# EAGLE design passive_template_v1_2 (EAGLE 4.16)
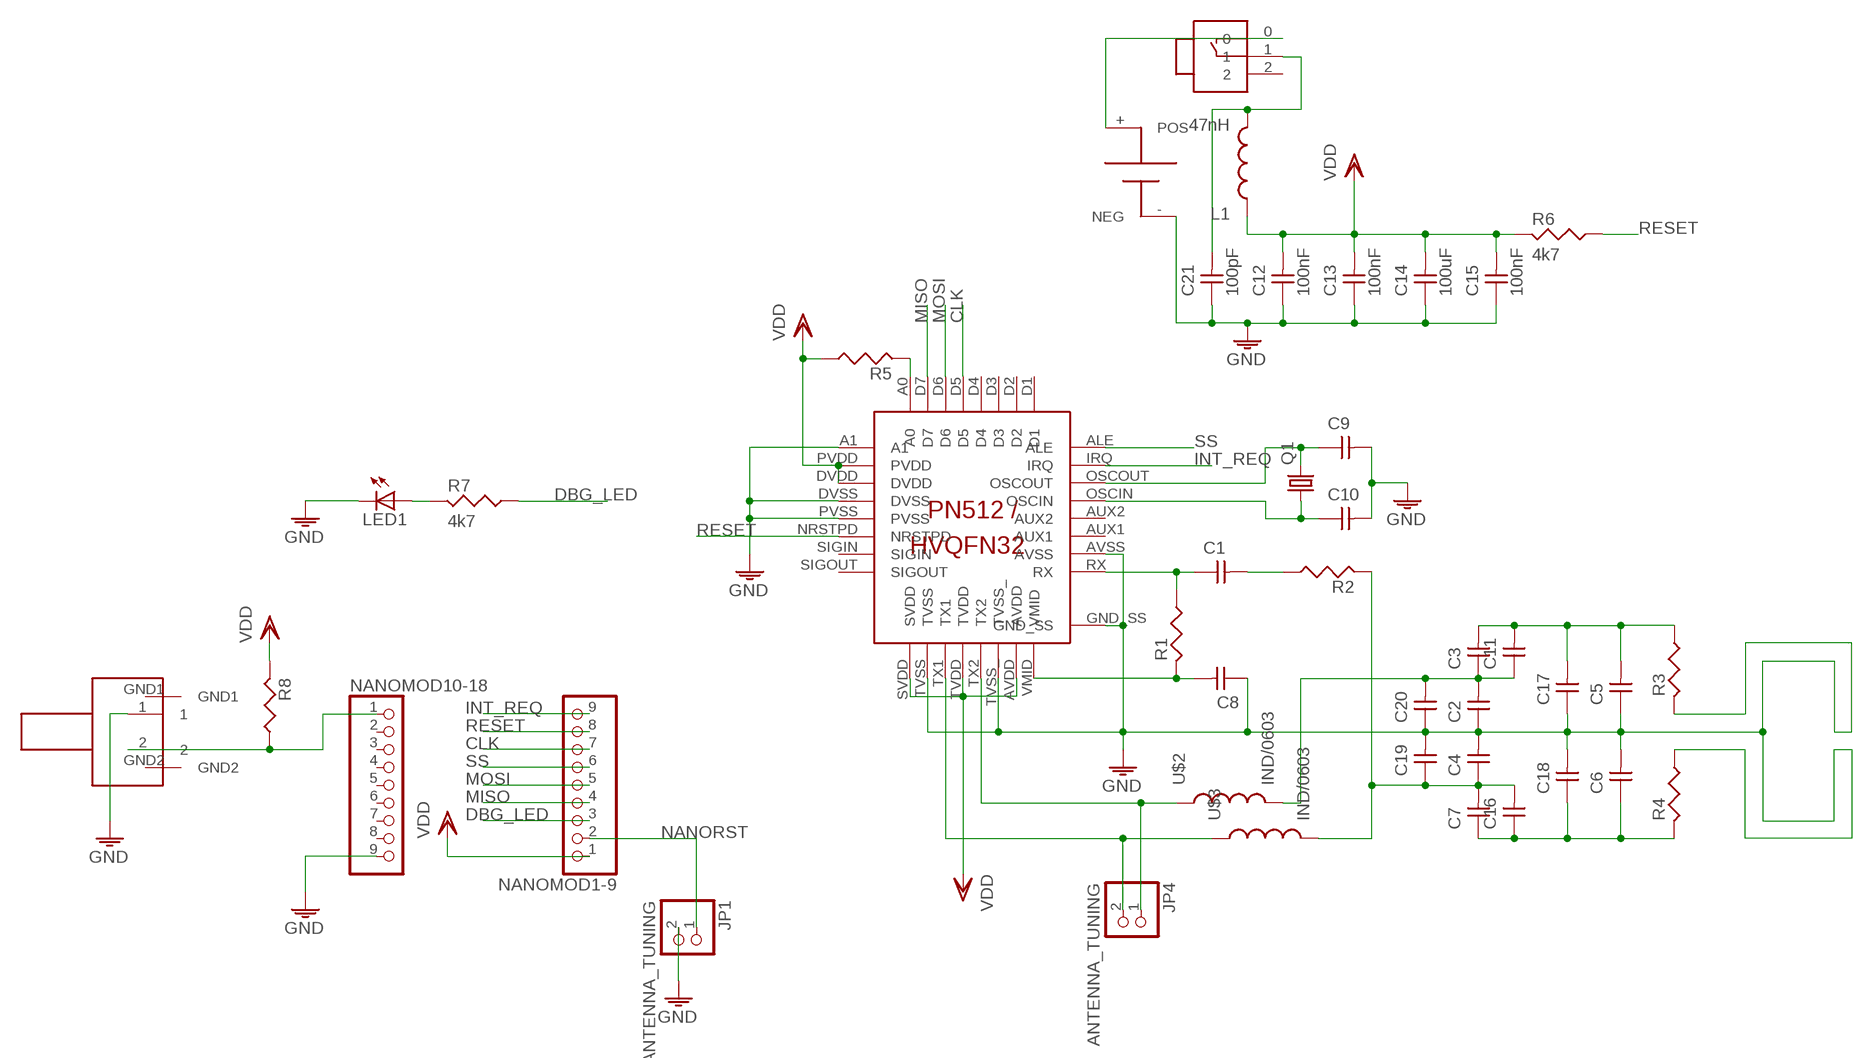
[diagram p0: schematic, sheet 1]

## Parts
C1  CAP/NP/0603  [SMD/0603/NP]
C2  CAP/NP/0603  [SMD/0603/NP]
C3  CAP/NP/0603  [SMD/0603/NP]
C4  CAP/NP/0603  [SMD/0603/NP]
C5  CAP/NP/0603  [SMD/0603/NP]
C6  CAP/NP/0603  [SMD/0603/NP]
C7  CAP/NP/0603  [SMD/0603/NP]
C8  CAP/NP/0603  [SMD/0603/NP]
C9  CAP/NP/0603  [SMD/0603/NP]
C10  CAP/NP/0603  [SMD/0603/NP]
C11  CAP/NP/0603  [SMD/0603/NP]
C12  100nF  CAP/NP/0805  [SMD/0805/NP]
C13  100nF  CAP/NP/0805  [SMD/0805/NP]
C14  100uF  CAP/NP/0805  [SMD/0805/NP]
C15  100nF  CAP/NP/0805  [SMD/0805/NP]
C16  CAP/NP/0603  [SMD/0603/NP]
C17  CAP/NP/0603  [SMD/0603/NP]
C18  CAP/NP/0603  [SMD/0603/NP]
C19  CAP/NP/0603  [SMD/0603/NP]
C20  CAP/NP/0603  [SMD/0603/NP]
C21  100pF  CAP/NP/0805  [SMD/0805/NP]
JP1  ANTENNA_TUNING  PINHD-1X2  [1X02]
JP4  ANTENNA_TUNING  PINHD-1X2  [1X02]
L1  47nH  IND/0805  [SMD/0805/NP]
LED1  LEDSFH482  [SFH482]
NANOMOD1-9  PINHD-1X9  [1X09]
NANOMOD10-18  PINHD-1X9  [1X09]
Q1  CRYSTAL/SM49  [SM49]
R1  RESISTOR/0603  [SMD/0603/NP]
R2  RESISTOR/0603  [SMD/0603/NP]
R3  RESISTOR/0603  [SMD/0603/NP]
R4  RESISTOR/0603  [SMD/0603/NP]
R5  RESISTOR/0603  [SMD/0603/NP]
R6  4k7  RESISTOR/0805  [SMD/0805/NP]
R7  4k7  RESISTOR/0805  [SMD/0805/NP]
R8  RESISTOR/0603  [SMD/0603/NP]
U$1  PN512  [PN512]
U$2  IND/0603  [SMA/0603]
U$3  IND/0603  [SMA/0603]
U$4  SMD/BAT  [SMD/BAT]
U$5  BUTN1  [BUTN1]
U$6  BUTN2  [BUTN2]

## Nets
CLK: NANOMOD1-9.7 U$1.D5
DBG_LED: NANOMOD1-9.3 R7.1
GND: C2.1 C4.2 C5.1 C6.2 C8.1 C9.2 C10.2 C12.1 C13.1 C14.1 C15.1 C17.1 C18.2 C19.2 C20.1 C21.1 JP1.2 LED1.K(C) NANOMOD10-18.9 R3.2 R4.1 U$1.A1 U$1.AVSS U$1.DVSS U$1.GND_SS U$1.PVSS U$1.TVSS U$1.TVSS_ U$4.-(NEG) U$6.1
INT_REQ: NANOMOD1-9.9 U$1.IRQ
MISO: NANOMOD1-9.4 U$1.D7
MOSI: NANOMOD1-9.5 U$1.D6
N$1: JP4.1 U$1.TX2 U$2.1
N$2: C1.1 R1.1 U$1.RX
N$3: C8.2 R1.2 U$1.VMID
N$4: JP4.2 U$1.TX1 U$3.1
N$5: C1.2 R2.1
N$6: C4.1 C7.2 C16.2 C19.1 R2.2 U$3.2
N$7: C2.2 C3.1 C11.1 C20.2 U$2.2
N$8: U$4.+(POS) U$5.0
N$9: C21.2 L1.2 U$5.1
N$10: R5.2 U$1.A0
N$12: C9.1 Q1.2 U$1.OSCOUT
N$13: C10.1 Q1.1 U$1.OSCIN
N$14: LED1.A R7.2
N$17: NANOMOD10-18.1 R8.1 U$6.2
N$18: C3.2 C5.2 C11.2 C17.2 R3.1
N$19: C6.1 C7.1 C16.1 C18.1 R4.2
NANORST: JP1.1 NANOMOD1-9.2
RESET: NANOMOD1-9.8 R6.1 U$1.NRSTPD
SS: NANOMOD1-9.6 U$1.ALE
VDD: C12.2 C13.2 C14.2 C15.2 L1.1 NANOMOD1-9.1 R5.1 R6.2 R8.2 U$1.AVDD U$1.DVDD U$1.PVDD U$1.SVDD U$1.TVDD
Unconnected: NANOMOD10-18.2 NANOMOD10-18.3 NANOMOD10-18.4 NANOMOD10-18.5 NANOMOD10-18.6 NANOMOD10-18.7 NANOMOD10-18.8 U$1.AUX1 U$1.AUX2 U$1.D1 U$1.D2 U$1.D3 U$1.D4 U$1.SIGIN U$1.SIGOUT U$5.2 U$6.GND1 U$6.GND2

## Library data of the parts
C1-C21 = atomi_sm:CAP/NP
JP1 JP4 = pinhead:PINHD-1X2: PIN HEADER
L1 = atomi_sm:IND
LED1 = led:LED: LED OSRAM: - CHIPLED LG R971, LG N971, LY N971, LG Q971, LY Q971, LO R971, LY R971 LH N974, LH R974 LS Q976, LO Q976, LY Q976 LO Q996 - Hyper CHIPLED LW Q18S LB Q993, LB Q99A, LB R99A - SideLED LS A670, LO A670, LY A670, LG A670, LP A670 LB A673, LV A673, LT A673, LW A673 LH A674 LY A675 LS A676, LA A676, LO A676, LY A676, LW A676 LS A679, LY A679, LG A679 - Hyper Micro SIDELED® LS Y876, LA Y876, LO Y876, LY Y876 LT Y87S - SmartLED LW L88C, LW L88S LB L89C, LB L89S, LG L890 LS L89K, LO L89K, LY L89K LS L896, LA L896, LO L896, LY L896 - TOPLED LS T670, LO T670, LY T670, LG T670, LP T670 LSG T670, LSP T670, LSY T670, LOP T670, LYG T670 LG T671, LOG T671, LSG T671 LB T673, LV T673, LT T673, LW T673 LH T674 LS T676, LA T676, LO T676, LY T676, LB T676, LH T676, LSB T676, LW T676 LB T67C, LV T67C, LT T67C, LS T67K, LO T67K, LY T67K, LW E67C LS E67B, LA E67B, LO E67B, LY E67B, LB E67C, LV E67C, LT E67C LW T67C LS T679, LY T679, LG T679 LS T770, LO T770, LY T770, LG T770, LP T770 LB T773, LV T773, LT T773, LW T773 LH T774 LS E675, LA E675, LY E675, LS T675 LS T776, LA T776, LO T776, LY T776, LB T776 LHGB T686 LT T68C, LB T68C - Hyper Mini TOPLED® LB M676 - Mini TOPLED Santana® LG M470 LS M47K, LO M47K, LY M47K Source: http://www.osram.convergy.de - LUMILED® LXK2-PW12-R00, LXK2-PW12-S00, LXK2-PW14-U00, LXK2-PW14-V00 LXK2-PM12-R00, LXK2-PM12-S00, LXK2-PM14-U00 LXK2-PE12-Q00, LXK2-PE12-R00, LXK2-PE12-S00, LXK2-PE14-T00, LXK2-PE14-U00 LXK2-PB12-K00, LXK2-PB12-L00, LXK2-PB12-M00, LXK2-PB14-N00, LXK2-PB14-P00, LXK2-PB14-Q00 LXK2-PR12-L00, LXK2-PR12-M00, LXK2-PR14-Q00, LXK2-PR14-R00 LXK2-PD12-Q00, LXK2-PD12-R00, LXK2-PD12-S00 LXK2-PH12-R00, LXK2-PH12-S00 LXK2-PL12-P00, LXK2-PL12-Q00, LXK2-PL12-R00 Source: www.luxeon.com
NANOMOD1-9 NANOMOD10-18 = pinhead:PINHD-1X9: PIN HEADER
Q1 = atomi_sm:CRYSTAL: CRYSTAL
R1-R8 = atomi_sm:RESISTOR
U$1 = RFIDlib:PN512
U$2 U$3 = _uusi:IND/0603
U$4 = _uusi:SMD/BAT
U$5 = _uusi:BUTN1
U$6 = _uusi:BUTN2

## Board
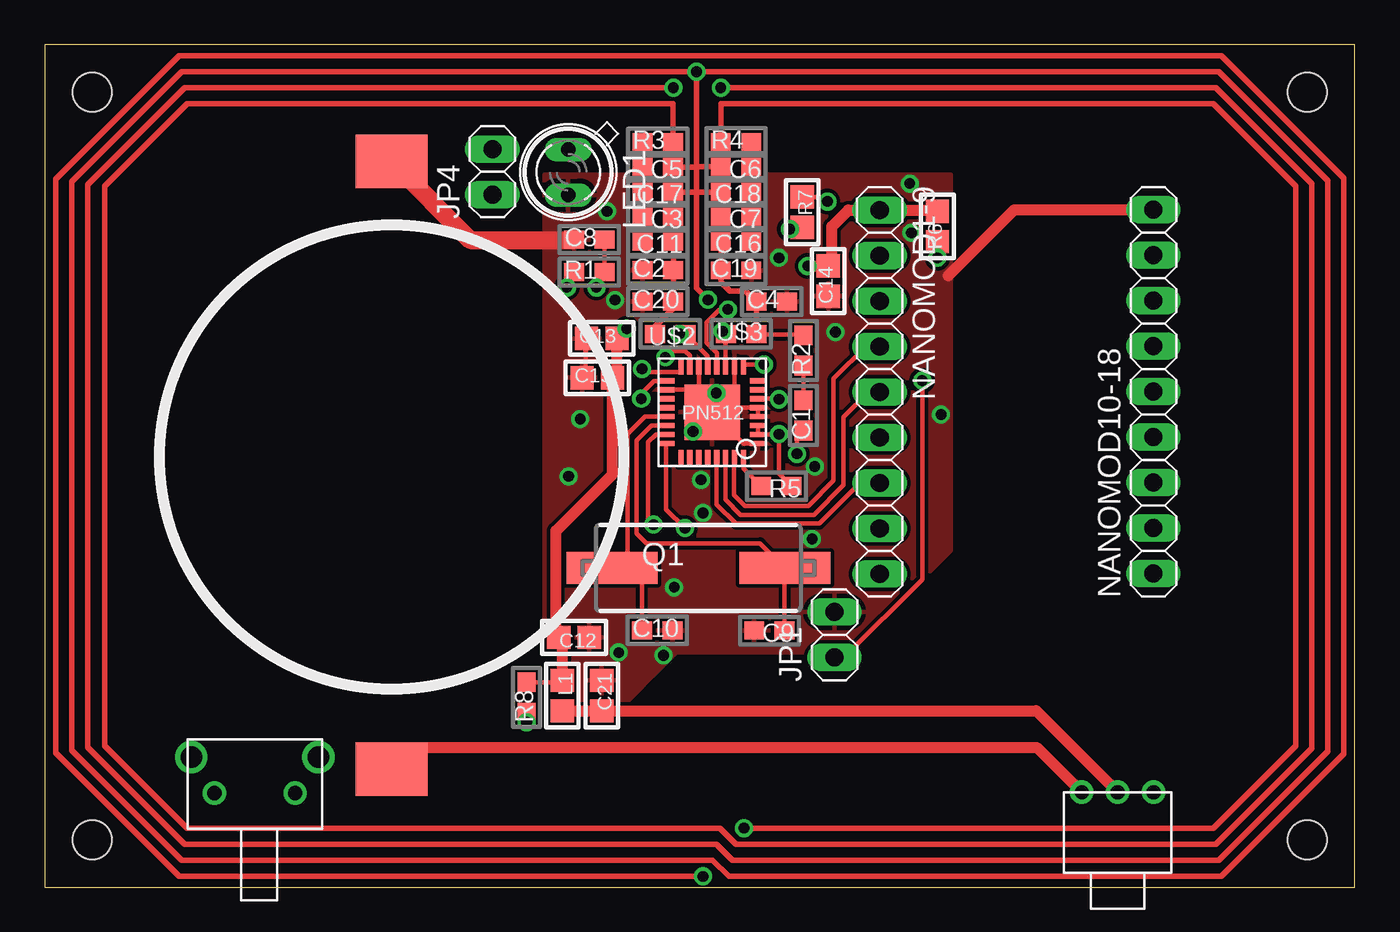
[diagram p1: board, top side]
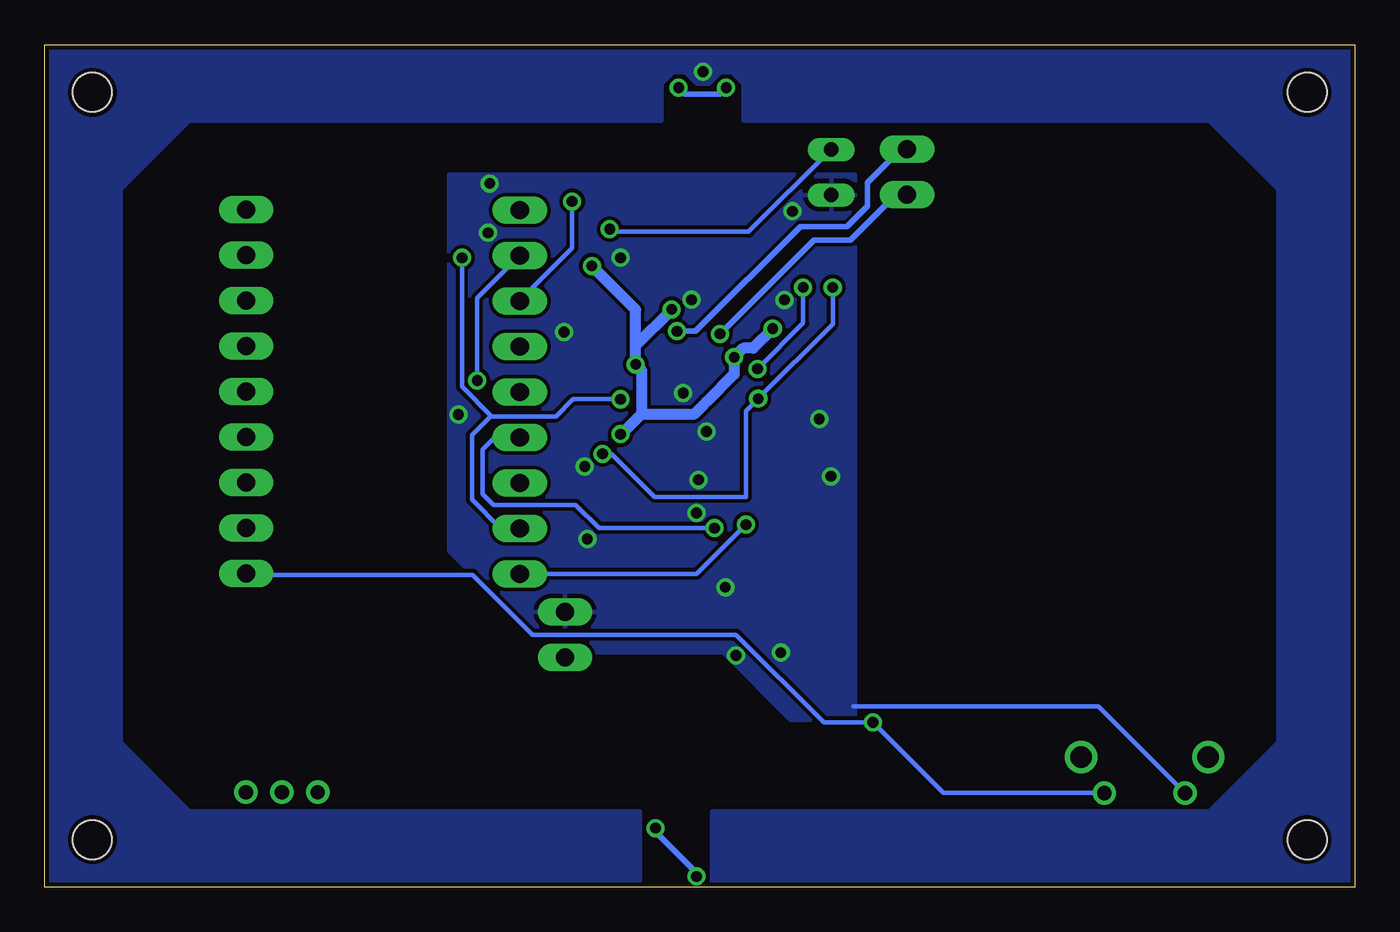
[diagram p2: board, bottom side, seen from below]

Size 73.15 x 47.05 mm. Coordinates in mm from the lower left corner, seen from the top.
Outline: 73.15,47.05 0,47.05 0,0 73.15,0 73.15,47.05
Copper layers (1*16): Top 0.0356mm / dielectric 1.5011mm / Bottom 0.0356mm
Design rules "Atomi": minimum track width 10mil, minimum drill 0.5994mm, track to track 8mil, track to pad 8mil, pad to pad 8mil, via to via 8mil, smd to smd 8mil, copper to edge 10mil, drill to drill 10mil, minimum pad ring 10mil, minimum via ring 8mil, stop-mask expansion 0mil, vias tented up to drill 0mil, thermal gap 10mil
Holes 2.2 mm at 70.5,44.4 2.65,44.4 70.5,2.65 2.65,2.65

### Footprints (pad centres in the part's own frame; a part is rotated, then mirrored left to right if it is on the bottom)
SMD/0603/NP = smd 1.1 x 1: 1 -0.85,0; 2 0.85,0
SMD/0805/NP = smd 1.3 x 1.3: 1 -0.85,0; 2 0.85,0
1X02 = drill 1.016 long: 1 -1.27,0; 2 1.27,0
SFH482 = drill 0.813 long: A -1.27,0; K 1.27,0
1X09 = drill 1.016 long: 1 -10.16,0; 2 -7.62,0; 3 -5.08,0; 4 -2.54,0; 5 0,0; 6 2.54,0; 7 5.08,0; 8 7.62,0; 9 10.16,0
SM49 = smd 5.08 x 1.778: 1 -4.826,0; 2 4.826,0
PN512 = smd 0.29 x 0.9: A0 -2.3,2.3; AVDD 0.7,-2.8; D1 1.2,2.3; D2 0.7,2.3; D3 0.2,2.3; D4 -0.3,2.3; D5 -0.8,2.3; D6 -1.3,2.3; D7 -1.8,2.3; SVDD -2.3,-2.8; TVDD -0.8,-2.8; TVSS -1.8,-2.8; TVSS_ 0.2,-2.8; TX1 -1.3,-2.8; TX2 -0.3,-2.8; VMID 1.2,-2.8 | smd 0.9 x 0.29: A1 -3.1,1.5; ALE 2,1.5; AUX1 2,-1; AUX2 2,-0.5; AVSS 2,-1.5; DVDD -3.1,0.5; DVSS -3.1,0; IRQ 2,1; NRSTPD -3.1,-1; OSCIN 2,0; OSCOUT 2,0.5; PVDD -3.1,1; PVSS -3.1,-0.5; RX 2,-2; SIGIN -3.1,-1.5; SIGOUT -3.1,-2 | smd 3.1 x 3.1: GND_SS -0.55,-0.25
SMA/0603 = smd 1.1 x 1: 1 -0.85,0; 2 0.85,0
SMD/BAT = smd 4 x 3: + 0,13.62; - 0,-20.32
BUTN1 = drill 0.8 round: 0 2.54,10.54; 1 2.54,8.54; 2 2.54,6.54
BUTN2 = drill 0.8 round: 1 0,9; 2 0,4.5 | drill 1.2 round: GND1 2,10.3; GND2 2,3.2

### Placement (x,y rotation side)
C1  42.37,26.35 90 top
C2  34.23,34.46 0 top
C3  34.23,37.44 180 top
C4  40.59,32.71 0 top
C5  34.23,40.22 180 top
C6  38.6,40.23 180 top
C7  38.6,37.45 180 top
C8  30.41,36.17 0 top
C9  40.46,14.33 180 top
C10  34.2,14.35 0 top
C11  34.23,36.05 180 top
C12  29.55,13.95 180 top
C13  31.1,30.65 0 top
C14  43.75,33.85 90 top
C15  30.85,28.45 0 top
C16  38.6,36.06 180 top
C17  34.23,38.83 180 top
C18  38.6,38.84 180 top
C19  38.6,34.45 0 top
C20  34.23,32.71 0 top
C21  31.1,10.7 270 top
JP1  44.1,14.1 90 top
JP4  25,39.95 90 top
L1  28.9,10.7 270 top
LED1  29.23,39.93 270 top
NANOMOD1-9  46.63,27.66 270 top
NANOMOD10-18  61.91,27.68 90 top
Q1  36.5,17.83 0 top
R1  30.41,34.35 0 top
R2  42.37,29.98 90 top
R3  34.23,41.61 0 top
R4  38.6,41.62 0 top
R5  40.85,22.4 180 top
R6  49.85,36.9 90 top
R7  42.3,37.7 270 top
R8  26.9,10.6 90 top
U$1  36.72,26.28 180 top
U$2  34.93,30.9 180 top
U$3  38.89,30.9 0 top
U$4  19.37,20.22 180 top
U$5  68.45,2.76 90 top
U$6  18.48,5.26 90 top

### Tracks (layer width: path | path; a pad name or v marks a point on that pad's centre or on a via)
CLK
  Top 0.254: NANOMOD1-9.7 45.53,22.58 43.25,20.3 38.6,20.3 37.52,21.38 U$1.D5
DBG_LED  (via drill 0.6)
  Top 0.254: R7.1 43.45,38.55 v43.7,38.3
  Bottom 0.254: NANOMOD1-9.3 46.65,32.75 43.7,35.7 v43.7,38.3
GND  (via drill 0.6)
  Top 0.254: U$1.PVSS 39.85,26.79 | 38.52,26.79 U$1.TVSS | 38.52,26.79 38.7,26.79 | 38.7,26.79 U$1.PVSS | U$1.PVSS | U$1.PVSS U$1.DVSS | U$1.A1 39.02,24.78 38.7,25.1 38.7,26.79 | C13.1 30.2,30.65 30.2,28.95 C15.1 | v29.25,22.95 29.35,22.95 | U$1.AVSS 34.72,27.8 36.52,27.8 | 36.52,27.8 U$1.TVSS_ | 36.52,27.8 37.5,27.8 v37.5,27.6 37.5,26.75 37.3,26.55 | 38.52,26.79 37.54,26.79 37.3,26.55 | 37.3,26.55 U$1.GND_SS | 37.3,26.55 v36.2,25.45 | v37.05,32.82 v37.05,32.8 v37.04,32.81 | 29.65,36.15 29.58,36.15 C8.1
  Top 0.305: R4.1 37.75,43.75 65.25,43.75 69.85,39.15 69.85,7.9 65.25,3.3 v39.05,3.3 | v37.05,32.82 36.4,33.47 36.4,38.83 | v36.4,45.55 65.55,45.55 71.65,39.45 71.65,7.6 65.55,1.5 38.4,1.5 37.5,2.4 7.8,2.4 2.4,7.8 2.4,39.25 2.5,39.35 | R3.2 35.08,43.75 7.95,43.75 3.35,39.15 3.35,7.9 7.95,3.3 37.7,3.3 38.6,2.4 65.4,2.4 70.75,7.75 70.75,39.3 65.4,44.65 v37.75,44.65 | 36.4,43.6 36.4,40.23 | 36.4,40.22 36.4,38.83 | 36.4,43.6 36.4,43.75 | v36.4,45.55 7.65,45.55 1.5,39.4 1.5,7.65 7.65,1.5 37.3,1.5 38.2,0.6 65.7,0.6 72.55,7.45 72.55,39.6 65.7,46.45 7.5,46.45 0.6,39.55 0.6,7.5 7.5,0.6 v36.75,0.6 | v35.1,44.65 7.8,44.65 2.5,39.35 | 2.5,39.35 2.45,39.3 | v36.4,45.55 36.4,43.6 | 36.4,40.22 C5.1 | 36.4,40.23 36.4,40.22 | 36.4,40.23 C6.2 | C18.2 36.42,38.83 | 36.4,38.83 36.42,38.83 | 36.42,38.83 C17.1
  Top 0.61: NANOMOD10-18.9 54.14,37.84 50.45,34.15
  Top 1.016: 29.53,36.2 C8.1 29.54,36.15 | C13.1 30.25,30.6 | U$4.- 23.76,36.15 29.58,36.15
  Bottom 0.254: U$6.1 14.32,10.1 28,10.1
  Bottom 0.305: v36.75,0.6 36.75,0.8 39.05,3.1 v39.05,3.3 | v35.1,44.65 35.45,44.3 37.4,44.3 v37.75,44.65
  other vias: 43,23.5 42.85,19.45 29.9,26.15 35.15,16.75 36.65,22.75 36.75,20.9 32.05,13.1 50.05,26.4 31.85,32.8 44.15,31 48.4,36.55 48.3,39.3 41,35.15 31.4,37.75 34.55,12.95
  pour Bottom: 27.9,9.35 27.9,39.8 50.58,39.8 50.58,18.79 44.9,13.1 35.25,13.1 31.5,9.35
  pour Top: 27.9,9.35 27.9,39.8 33.75,39.8 33.75,31.7 39.05,31.7 39.05,39.8 50.6,39.8 50.6,18.8 44.9,13.1 35.25,13.1 31.5,9.35
  pour Bottom: 34.75,45.55 35.45,45.55 36.1,44.9 36.7,44.9 37.35,45.55 38.1,45.55 38.75,44.9 38.75,42.85 65.1,42.85 68.95,39 68.95,8.05 65.1,4.2 39.95,4.2 39.95,0 73.15,0 73.15,47.05 0,47.05 0,0 35.85,0 35.85,4.2 8.1,4.2 4.25,8.05 4.25,39 8.1,42.85 34.1,42.85 34.1,44.9
INT_REQ  (via drill 0.6)
  Top 0.254: U$1.IRQ 34.13,25.28 33.7,24.85 33.7,20.55 v34,20.25
  Bottom 0.254: v34,20.25 36.75,17.5 NANOMOD1-9.9
MISO
  Top 0.254: U$1.D7 38.5,24 38.5,21.9 39.1,21.3 42.65,21.3 44.05,22.7 44.05,28.4 45.9,30.25 46.65,30.25 46.65,30.22 NANOMOD1-9.4
MOSI
  Top 0.254: U$1.D6 38,24 38,21.65 38.85,20.8 42.95,20.8 44.6,22.45 44.6,26.25 46.01,27.66 NANOMOD1-9.5
N$1  (via drill 0.6)
  Top 0.254: U$1.TX2 37.02,29.65 35.81,30.86 35.81,30.87 U$2.1 | U$2.1 35.8,30.9 | v35.45,30.9 U$2.1
  Bottom 0.305: JP4.1 25.62,38.68 28.15,36.15 30.2,36.15 v35.45,30.9
N$2  (via drill 0.6)
  Top 0.254: U$1.RX 34.75,28.26 34.01,28.26 33.3,27.55 33.31,27.54 v33.31,27.28 | 29.5,34.35 R1.1 29.15,34.35 v29.15,33.5 | C1.1 42,25.13 v42,24.2
  Bottom 0.254: v42,24.2 41.5,24.2 39.1,21.8 34,21.8 34,26.59 v33.31,27.28 v33.31,27.29 29.15,31.45 v29.15,33.5
N$3  (via drill 0.6)
  Top 0.254: U$1.VMID 35.52,28.76 33.54,28.76 v33.35,28.95 | R1.2 31.25,34.4 | C8.2 31.25,36.25 | C8.2 | R1.2 31.26,34.44 31.25,34.45 | 31.25,34.45 R1.2 | 31.25,34.45 C8.2 | v30.8,33.5 30.8,34 31.25,34.45
  Bottom 0.254: v33.35,28.95 30.8,31.5 v30.8,33.5
N$4  (via drill 0.6)
  Top 0.254: U$1.TX1 38,29.08 38,30.9 | 38,30.9 U$3.1 | v37.85,31.05 38,30.9
  Bottom 0.305: v37.85,31.05 36.8,31.05 30.95,36.9 28.35,36.9 27.2,38.05 27.2,39.35 25.33,41.22 JP4.2
N$5
  Top 0.254: C1.2 R2.1 42.03,29.13
N$6
  Top 0.254: 39.74,30.85 39.71,30.85 | U$3.2 39.74,30.85 | R2.2 42.02,30.85 39.74,30.85 | C4.1 39.7,32.8 39.66,32.76
  Top 0.305: 39.7,32.7 39.71,32.71 39.66,32.76 39.12,33.3 38.25,33.3 37.75,33.8 C19.1 37.75,34.42 | 37.75,34.42 C16.2 37.75,37.43 | 37.75,34.42 37.74,34.42 | 37.75,37.43 C7.2 | 37.75,37.43 37.74,37.43 | C4.1 U$3.2
N$7
  Top 0.254: 35.1,34.5 C2.2
  Top 0.305: U$2.2 34.08,31.31 35.08,32.3 C20.2 | 35.1,34.45 35.1,34.35 | 35.1,34.45 C2.2 | C20.2 35.1,32.73 35.1,34.45 | C3.1 C11.1 35.1,36.03 35.1,34.5 35.1,34.45
  Top 0.61: C20.2
N$8
  Top 0.61: U$4.+ 19.37,7.8 55.4,7.8 U$5.0
N$9
  Top 0.61: 28.75,9.7 L1.2 C21.2 | C21.2 31.05,9.8 | C21.2 31.1,9.75 | U$5.1 55.36,9.85 C21.2
N$10
  Top 0.254: U$1.A0 39.02,23.38 R5.2
N$12
  Top 0.254: U$1.OSCOUT 33.88,25.78 33.05,24.95 33.05,19.75 33.6,19.2 39.95,19.2 Q1.2 | 42.5,17.85 42.48,17.83 Q1.2 | Q1.2 41.3,17.8 C9.1
N$13
  Top 0.254: U$1.OSCIN 33.53,26.28 32.55,25.3 32.55,18.05 | C10.1 33.35,16.95 | 33.35,16.95 33.35,17 | 32.55,18.05 33.35,17.25 33.35,16.95 | Q1.1 31.69,17.85 32.35,17.85 32.55,18.05
N$14  (via drill 0.6)
  Top 0.254: v41.6,36.75 41.7,36.85 R7.2
  Bottom 0.254: 33.85,36.6 41.45,36.6 v41.6,36.75 | 33.85,36.6 33.84,36.6 | 29.27,41.17 33.85,36.6 | 29.27,41.17 29.23,41.22 | LED1.A 29.3,41.2 29.27,41.17
N$17  (via drill 0.6)
  Top 0.254: v26.9,9.2 R8.1
  Bottom 0.254: NANOMOD10-18.1 61.95,17.48 61.95,17.45 50.45,17.45 | 50.45,17.45 50.25,17.45 | 50.45,17.45 49.25,17.45 45.9,14.1 34.55,14.1 29.65,9.2 v26.9,9.2 22.96,5.26 U$6.2
N$18
  Top 0.305: R3.1 C5.2 C17.2 | C17.2 | 33.38,37.35 33.38,37.33 | C17.2 C3.2 33.38,37.35 | C11.2 33.38,37.35
N$19
  Top 0.305: R4.2 C6.1 C18.1 | C16.1 C7.1 | C7.1 39.45,37.48 39.44,37.48 | C18.1 39.45,38.82 39.44,38.82 | 39.45,38.72 C18.1 | C7.1 39.45,38.72 | 39.45,38.72 39.44,38.72
NANORST  (via drill 0.6)
  Top 0.254: v49,28.3 49,17.2 44.65,12.85 44.08,12.85 | 44.08,12.85 44.05,12.85 | JP1.1 44.08,12.85
  Bottom 0.254: NANOMOD1-9.2 49,32.91 v49,28.3
RESET  (via drill 0.6)
  Top 0.254: U$1.NRSTPD 40.92,27.28 v41,27.25 | 46.6,20.05 46.62,20.05 NANOMOD1-9.8 | 49.85,36.1 R6.1 v49.85,35.15
  Bottom 0.254: v41,27.25 43.65,27.25 44.6,26.3 48.2,26.3 | 48.2,26.3 48.25,26.3 49.3,25.25 49.3,21.65 47.69,20.04 NANOMOD1-9.8 | 48.2,26.3 49.85,27.95 v49.85,35.15
SS  (via drill 0.6)
  Top 0.254: U$1.ALE 34.7,24.8 34.7,21.1 v35.75,20.05
  Bottom 0.254: NANOMOD1-9.6 46.65,25.1 48.05,25.1 48.7,24.45 48.7,21.95 48.1,21.35 43.5,21.35 42.2,20.05 v35.75,20.05
VDD  (via drill 0.6)
  Top 0.254: U$1.TVDD 37.54,29.43 37.54,29.83 36.94,30.43 36.94,31.53 37.68,32.27 v38.14,32.27 | 39.84,25.28 U$1.PVDD | U$1.DVDD 39.84,25.78 39.84,25.28 | U$1.AVDD 36.02,29.69 35.76,29.95 35,29.95 v34.65,29.6 | R5.1 41,23.1 v41,25.3 40.98,25.28 39.84,25.28 | U$1.SVDD 39.02,29.18 39,29.2 v40.15,29.2 | R6.2 49.85,37.8 49.83,37.82 | C14.2 43.6,34.6 | C15.2 31.95,29 | L1.1 28.9,11.45 R8.2
  Top 0.61: 49.83,37.82 NANOMOD1-9.1 44.87,37.82 43.95,36.9 43.95,34.7 C14.2 v42.6,34.7 | 31.95,29 C13.2 v32.5,31.2 | 31.7,28.55 C15.2 31.7,23.05 28.55,19.9 28.55,13.95 C12.2 28.9,13.95 L1.1
  Bottom 0.254: v38.15,32.26 v38.14,32.27 v38.13,32.27 38.1,32.3 | 36.4,26.9 36.3,26.8 36.2,27.1 | 39.5,26.4 39.8,26.46 | 40.98,25.28 v41,25.3
  Bottom 0.61: 40.15,30.25 v40.15,29.2 39.8,28.85 39.8,26.46 40.98,25.28 | 40.15,30.25 v38.13,32.27 | 40.15,30.25 40.15,32.25 v42.6,34.7 | 36.2,27.1 34.65,28.65 v34.65,29.6 34.15,30.1 33.6,30.1 v32.5,31.2 | 39.85,26.4 39.5,26.4 36.9,26.4 36.4,26.9 36.35,26.95